# Altium schematic sheet SolBoutout.SchDoc
size A4; SheetNumber: 4; SheetTotal: 5
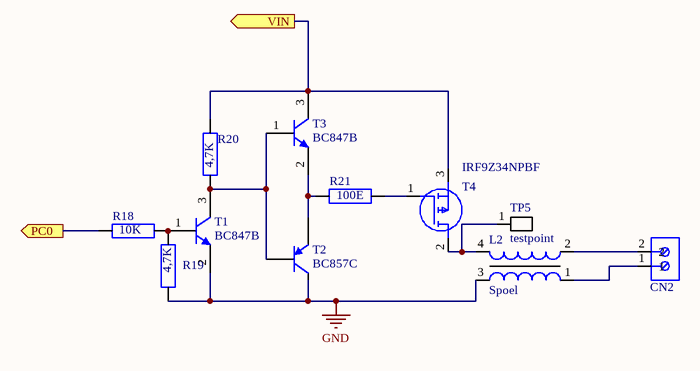
[diagram p0: SolBoutout.SchDoc]

## Parts
CN2  282836-2  [cnn2pin]  (value not drawn)
L2  Spoel  [CoilCM2545]
R18  10K  [res0805ph]
R19  4,7K  [res0805ph]
R20  4,7K  [res0805ph]
R21  100E  [res0805ph]
T1  BC847B  [sot23]
T2  BC857C  [INF-SOT23_N]
T3  BC847B  [sot23]
T4  IRF9Z34NPBF  [TO254P469X1042X1967-3P]
TP5  testpoint  [testpin]

## Ports
PC0 (out), VIN (out)

## Nets
GND: L2.3 R19.2 T1.2(E) T2.3(C)
PC0: R18.1 ; port PC0
VIN: R20.1 T3.3(C) T4.3(S) ; port VIN
NetCN2_1: CN2.1 L2.1
NetCN2_2: CN2.2 L2.2
NetL2_4: L2.4 T4.2(D) TP5.1(TP)
NetR18_2: R18.2 R19.1 T1.1(B)
NetR20_2: R20.2 T1.3(C) T2.1(B) T3.1(B)
NetR21_1: R21.1 T4.1(G)
NetR21_2: R21.2 T2.2(E) T3.2(E)

## Library data of the parts
CN2 = CNN2P: Female Header, Pitch 5 mm, 1 x 2 Position, Height 10 mm, Tail Length 3.5 mm, Rohs, Bulk; Manufacturer: TE Connectivity; Wire Gauge: 16-30AWG; Product Training Modules: Wire-to-BoardEurostyleTerminalBlocks; Clamp Material - Plating: Brass-NickelPlated; Voltage: 300V; Mating Orientation: HorizontalwithBoard; Current: 13.5A; Pitch: 0.197"(5.00mm); Screw Thread: M3; 3D Model: 282836-2.pdf; Other Names: 5ULV-02B / A98076; Dynamic Catalog: BuchananSeries; Number of Levels: 1; Torque - Screw: 0.68Nm(6Lb-In); Featured Product: EurostyleTerminalBlockConnectors; Positions Per Level: 2; Wire Termination: Screw-RisingCageClamp; Datasheet URL: http://www.te.com.cn/commerce/DocumentDelivery/DDEController?Action=showdoc&DocId=Catalog+Section%7F1308389_EUROSTYLE_TERMINAL_BLOCKS%7F0607%7Fpdf%7FEnglish%7FENG_CS_1308389_EUROSTYLE_TERMINAL_BLOCKS_0607.pdf%7F282836-2; Color: Green; Family: TerminalBlocks-WiretoBoard; RoHS Information: 282836-2StatementofCompliance; Standard Package: 300; Contact Material - Plating: Brass-TinPlated; Manufacturer URL: http://www.te.com; Housing Material: Polyamide(PA66),Nylon6/6; Features: Interlocking(Side); Package Description: Female Header, Pitch 5 mm, 1 x 2 Position, Height 10 mm, Tail Length 3.5 mm; Mounting Type: ThroughHole; Package Reference: THD; Packaging: Bulk; Series: Buchanan; Category: Connectors,Interconnects; Screw Material - Plating: Brass-NickelPlated
R18-R21 = Res: Resistor; Manufacturer_Name: TE Connectivity; Manufacturer_Part_Number: CPF0201D10K2C1; Datasheet Link: http://www.te.com/commerce/DocumentDelivery/DDEController?Action=showdoc&DocId=Data+Sheet%7F1773200-1%7FA%7Fpdf%7FEnglish%7FENG_DS_1773200-1_A.pdf%7F4-2176215-6; Height: 0.28mm; Mouser Part Number: N/A; Mouser Price/Stock: https://www.mouser.com/Search/Refine.aspx?Keyword=N%2FA
T1 T3 = BC847: NPN Silicon AF Transistor, 45 V VCEO, 100 mA IC, SOT23, Reel, Green; Manufacturer: Infineon; VEBO (max): 6Â V; ICBO (max): 15Â nA; VCBO (max): 50Â V; IBM (max): 200Â mA; Green: TRUE; Ptot (max): 330Â mW; fT (typ): 250Â MHz; IC (max): 100Â mA; VCEO (max): 45Â V; PackageDescription: 3-Pin Small Outline Transistor Package, 1.3 x 2.9 mm Body, 0.95 mm Pitch; ComponentLink3URL: http://www.infineon.com/dgdl/SOT23-Package_Overview.pdf?folderId=db3a30431936bc4b0119532290053c66&fileId=db3a30431936bc4b0119533468123c85; PackageVersion: Apr-08; Packing: Reel; ComponentLink3Description: Package Specification; ComponentLink2URL: http://www.infineon.com/dgdl/bc847series_bc848series_bc849series_bc850series.pdf?folderId=db3a304314dca389011541d30fa21656&fileId=db3a304314dca389011541d4630a1657; ComponentLink1URL: http://www.infineon.com/; ComponentLink2Description: Datasheet; Polarity: NPN; Mounting Technology: Surface Mount; PackageReference: SOT23; ICM (max): 200Â mA; ComponentLink1Description: Manufacturer URL; PartNumber: BC847B
T2 = CMP-1177-00039-1: PNP Silicon AF Transistor, 45 V VCEO, 100 mA IC, SOT23, Reel, Green; Manufacturer: Infineon; VCBO (max): 50Â V; fT (typ): 250Â MHz; ICBO (max): 15Â nA; IC (max): 100Â mA; Green: TRUE; IBM (max): 200Â mA; VEBO (max): 5Â V; VCEO (max): 45Â V; Ptot (max): 330Â mW; PackageDescription: 3-Pin Small Outline Transistor Package, 1.3 x 2.9 mm Body, 0.95 mm Pitch; ComponentLink2Description: Datasheet; PackageReference: SOT23; ComponentLink3Description: Package Specification; ComponentLink1URL: http://www.infineon.com/; ComponentLink1Description: Manufacturer URL; Mounting Technology: Surface Mount; PackageVersion: Apr-08; ComponentLink3URL: http://www.infineon.com/dgdl/SOT23-Package_Overview.pdf?folderId=db3a30431936bc4b0119532290053c66&fileId=db3a30431936bc4b0119533468123c85; ComponentLink2URL: http://www.infineon.com/dgdl/bc857series_bc858series_bc859series_bc860series.pdf?folderId=db3a304314dca389011541d30fa21656&fileId=db3a304314dca389011541da0e3a1661; Polarity: PNP; ICM (max): 200Â mA; PartNumber: BC857C; Packing: Reel
T4 = IRF9Z34NPBF: MOSFET (P-Channel); Manufacturer_Name: Infineon; Datasheet Link: https://www.infineon.com/dgdl/irf9z34npbf.pdf?fileId=5546d462533600a40153561220af1ddd; Height: 4.69mm; Manufacturer_Part_Number: IRF9Z34NPBF; Mouser Part Number: 942-IRF9Z34NPBF; Mouser Price/Stock: https://www.mouser.co.uk/ProductDetail/Infineon-IR/IRF9Z34NPBF?qs=9%252BKlkBgLFf16a%2FvlD%252BMCtQ%3D%3D; Arrow Part Number: IRF9Z34NPBF; Arrow Price/Stock: https://www.arrow.com/en/products/irf9z34npbf/infineon-technologies-ag?region=nac